# EAGLE schematic Matias_OBC-v.3.0 (EAGLE 9.4.2)
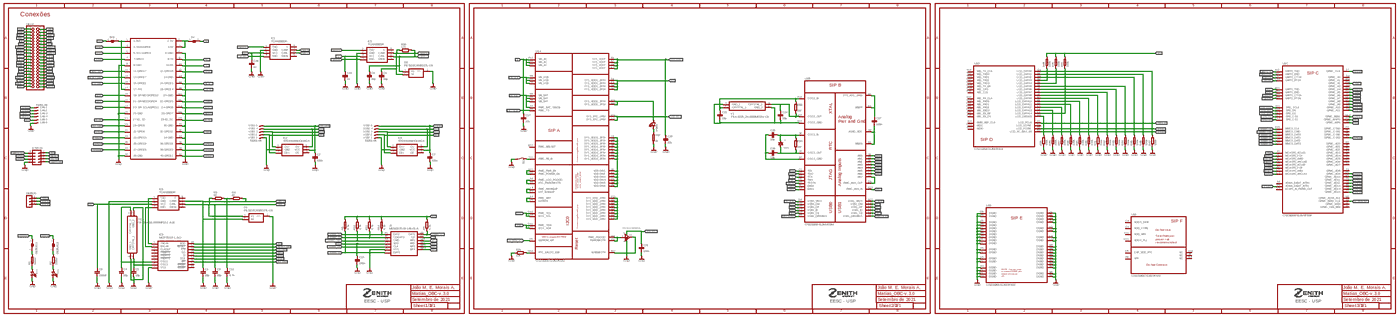
[diagram p0: schematic, sheet 1, overview]
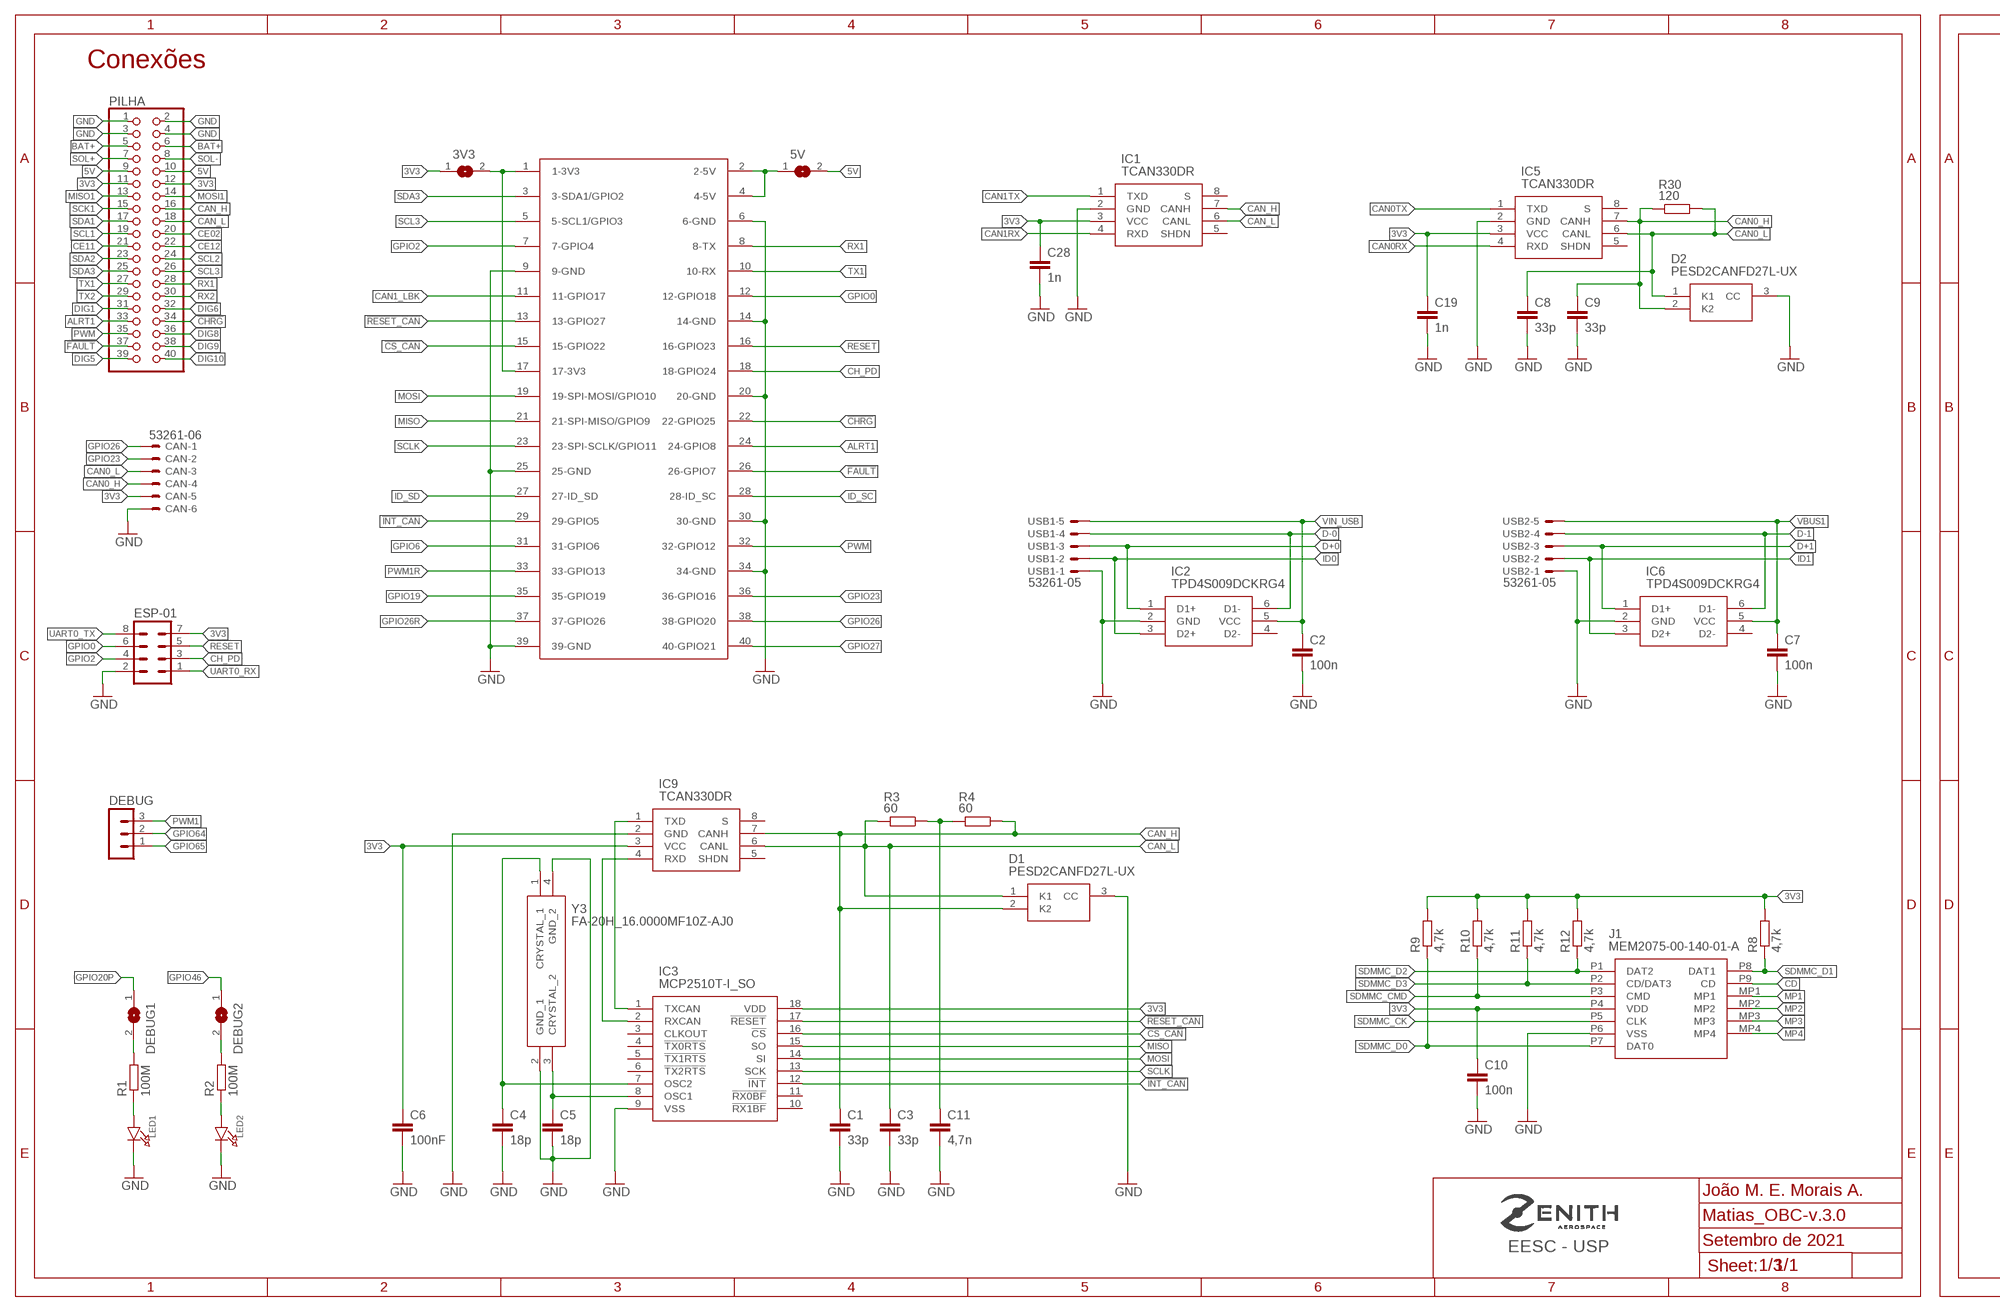
[diagram p1: schematic, sheet 1, part 1 of 4]
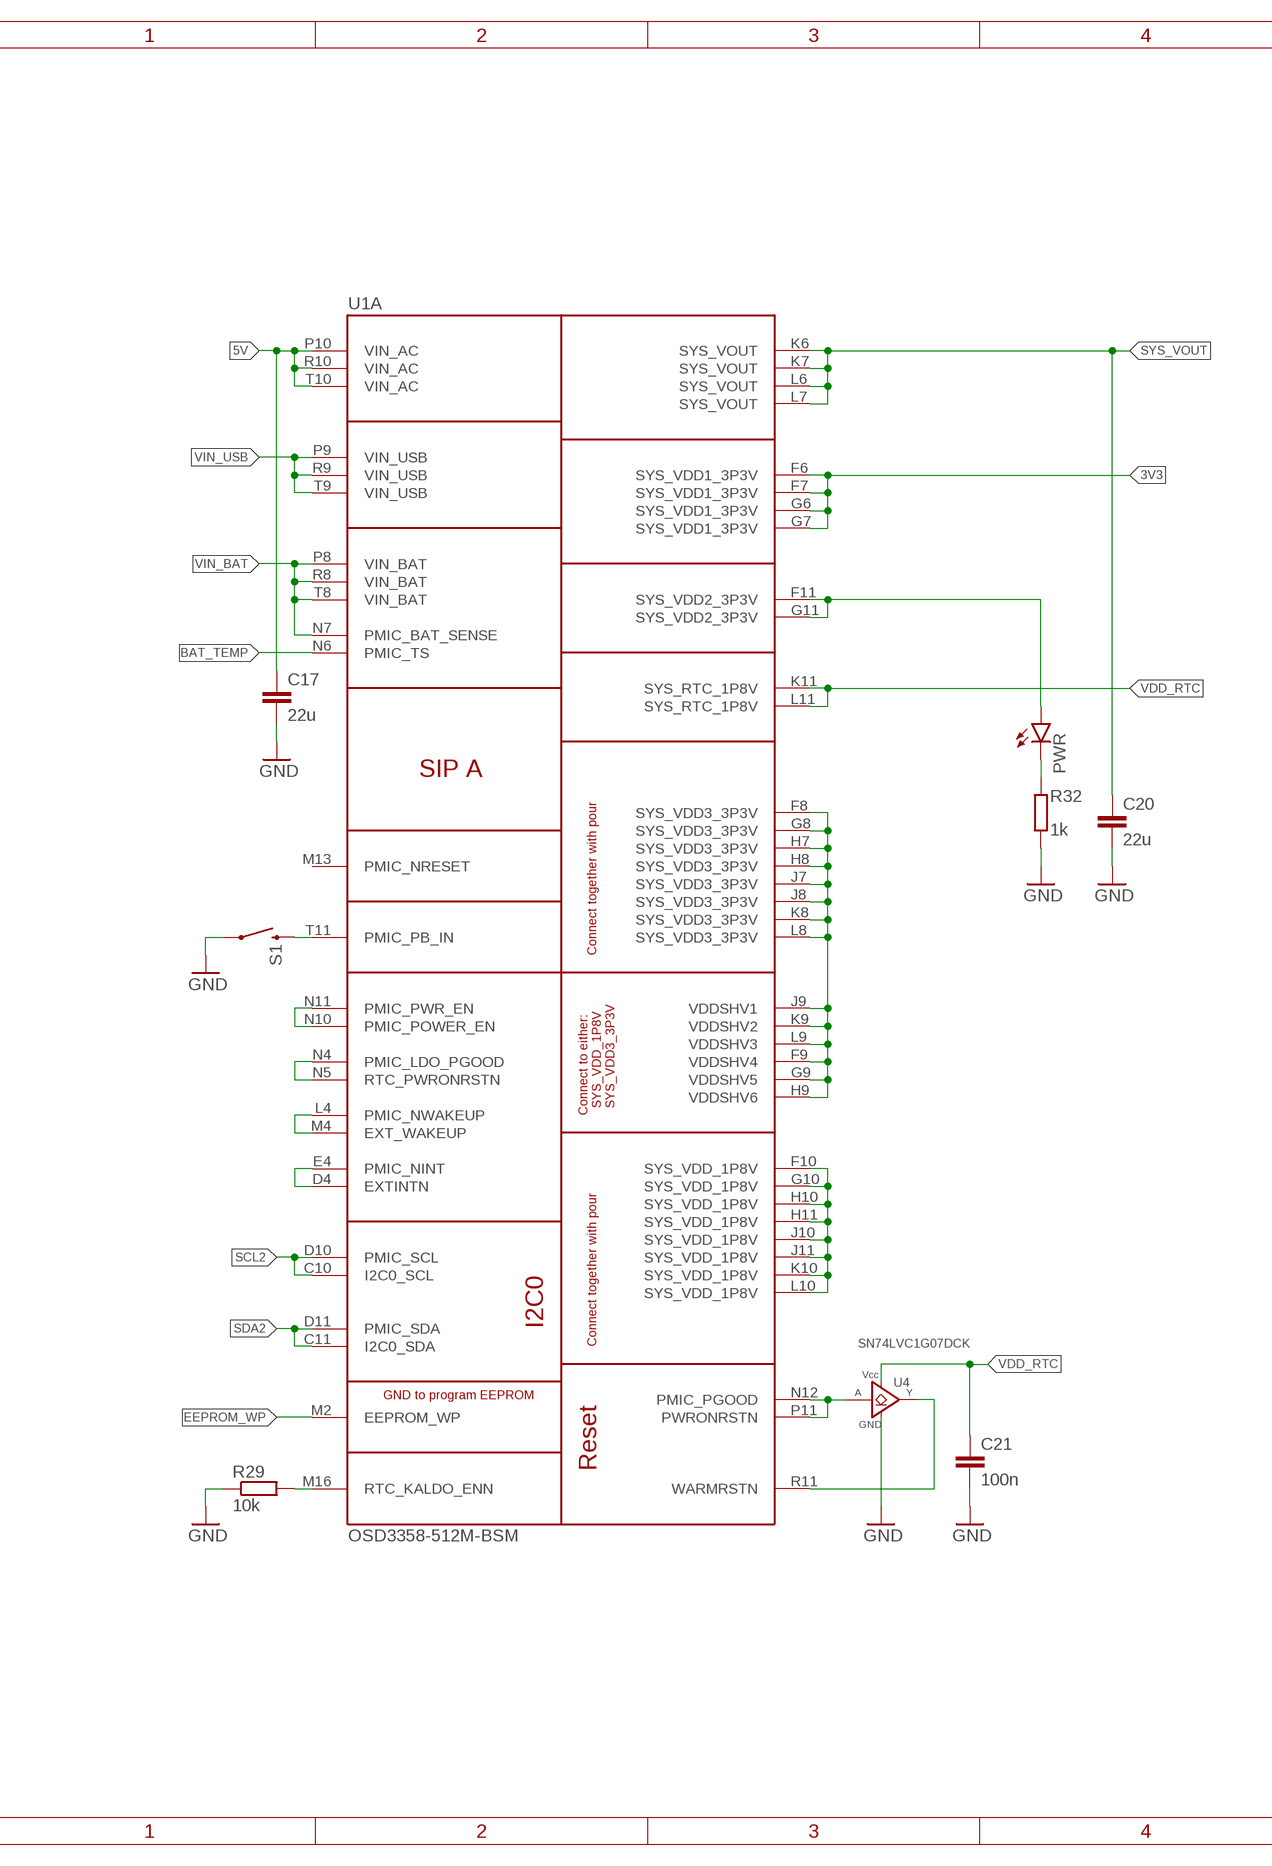
[diagram p2: schematic, sheet 1, part 2 of 4]
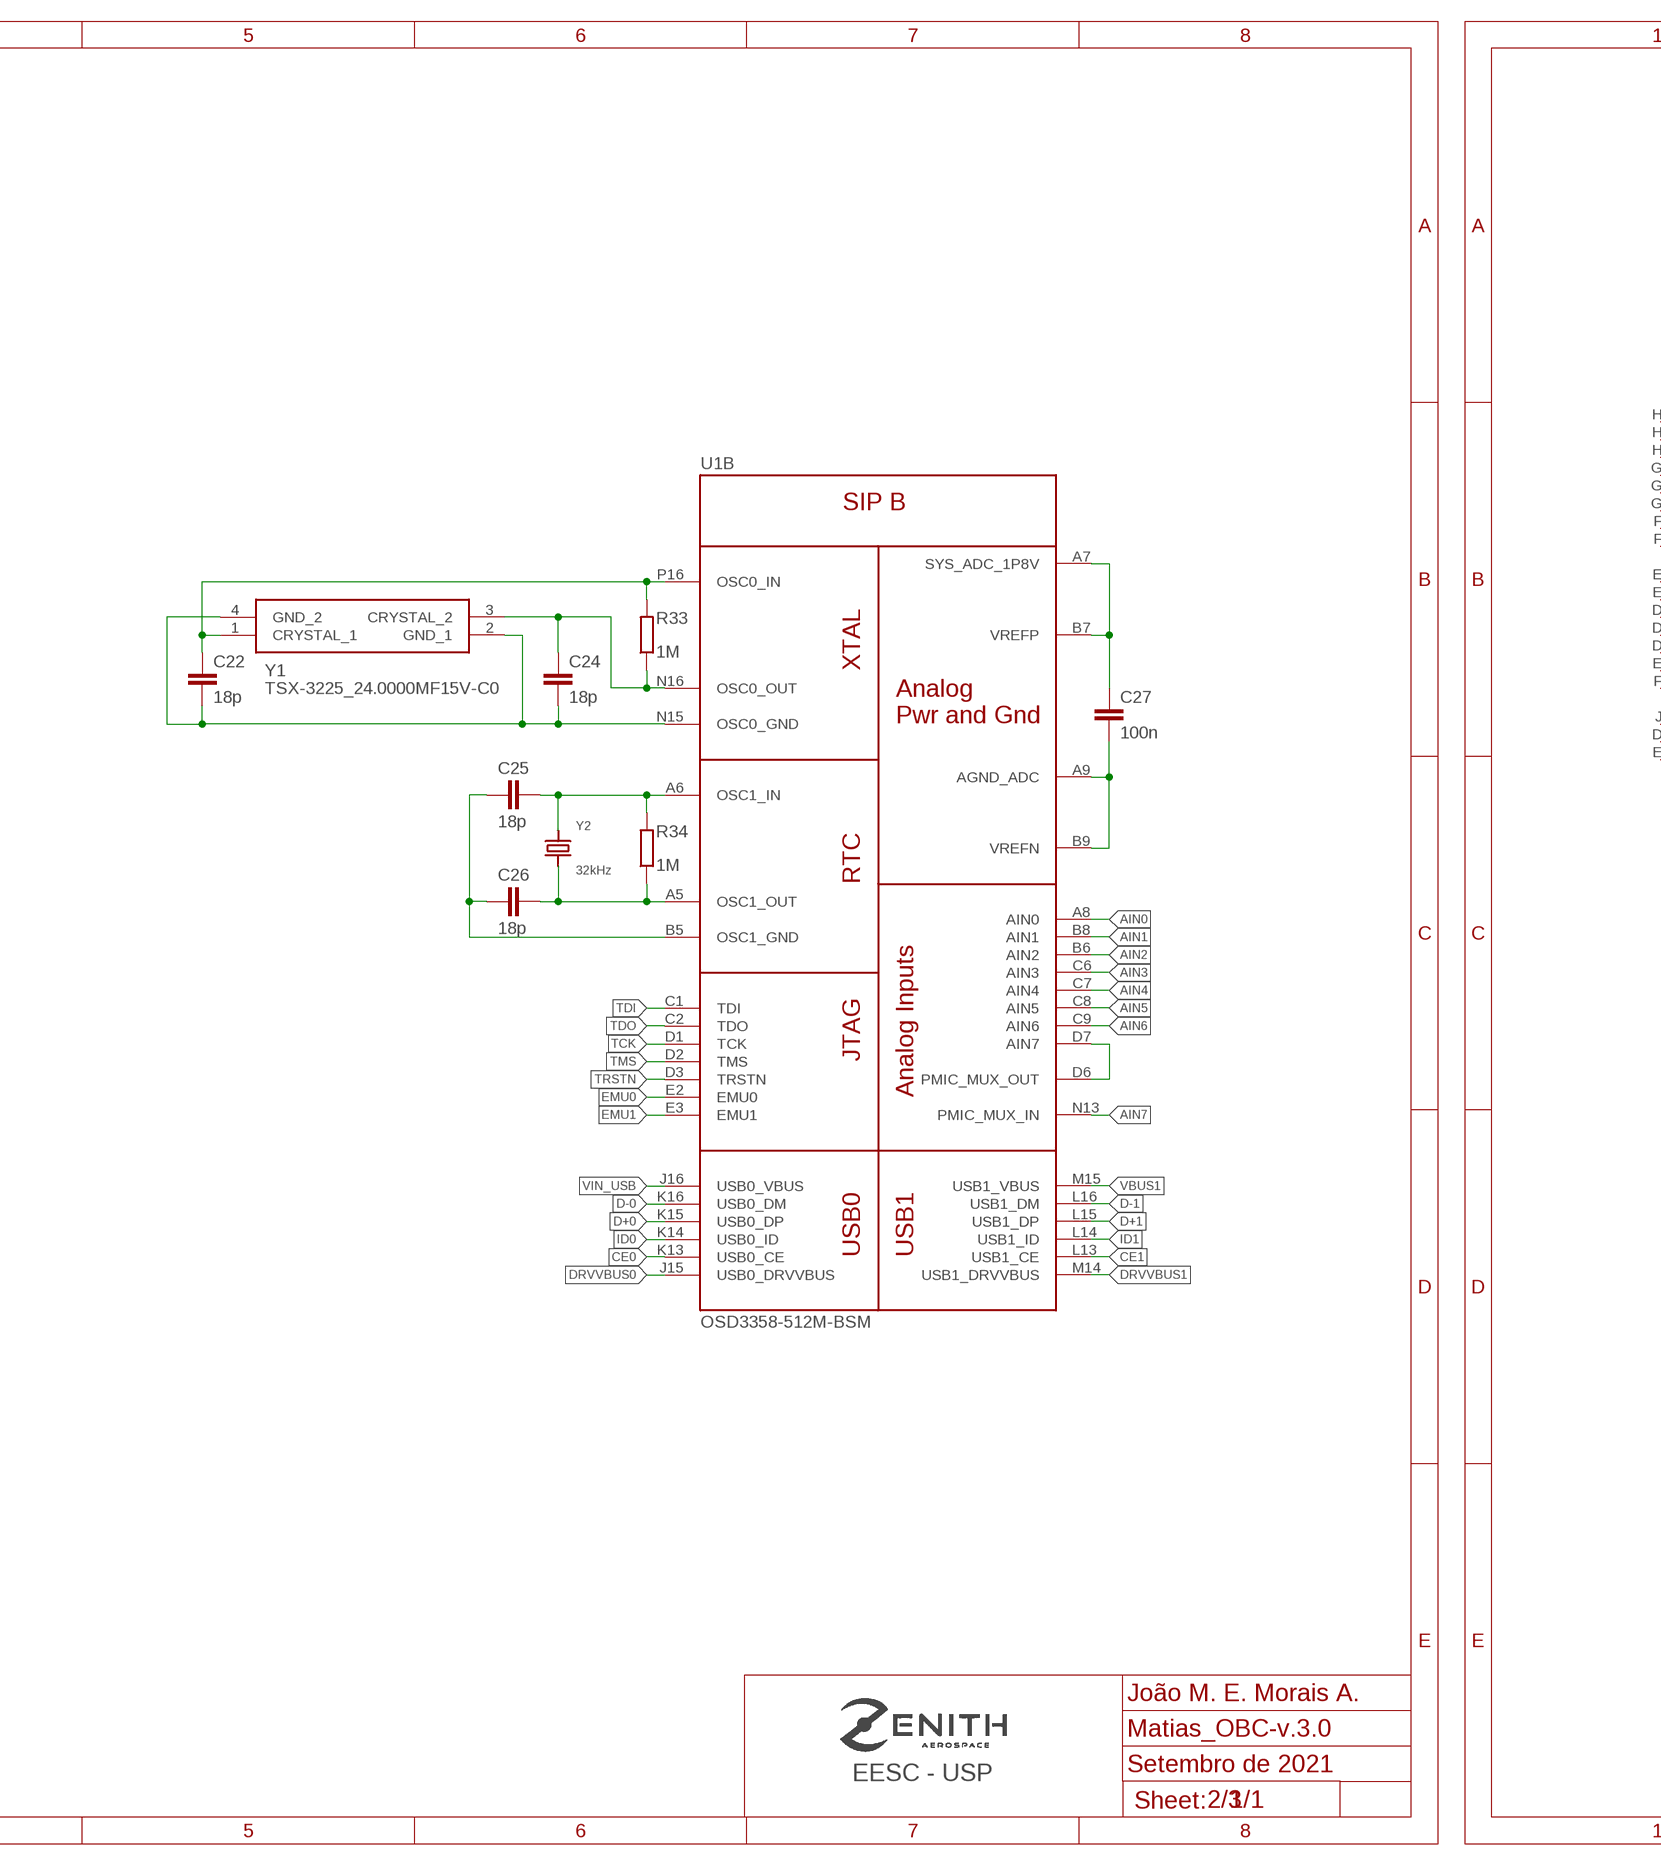
[diagram p3: schematic, sheet 1, part 3 of 4]
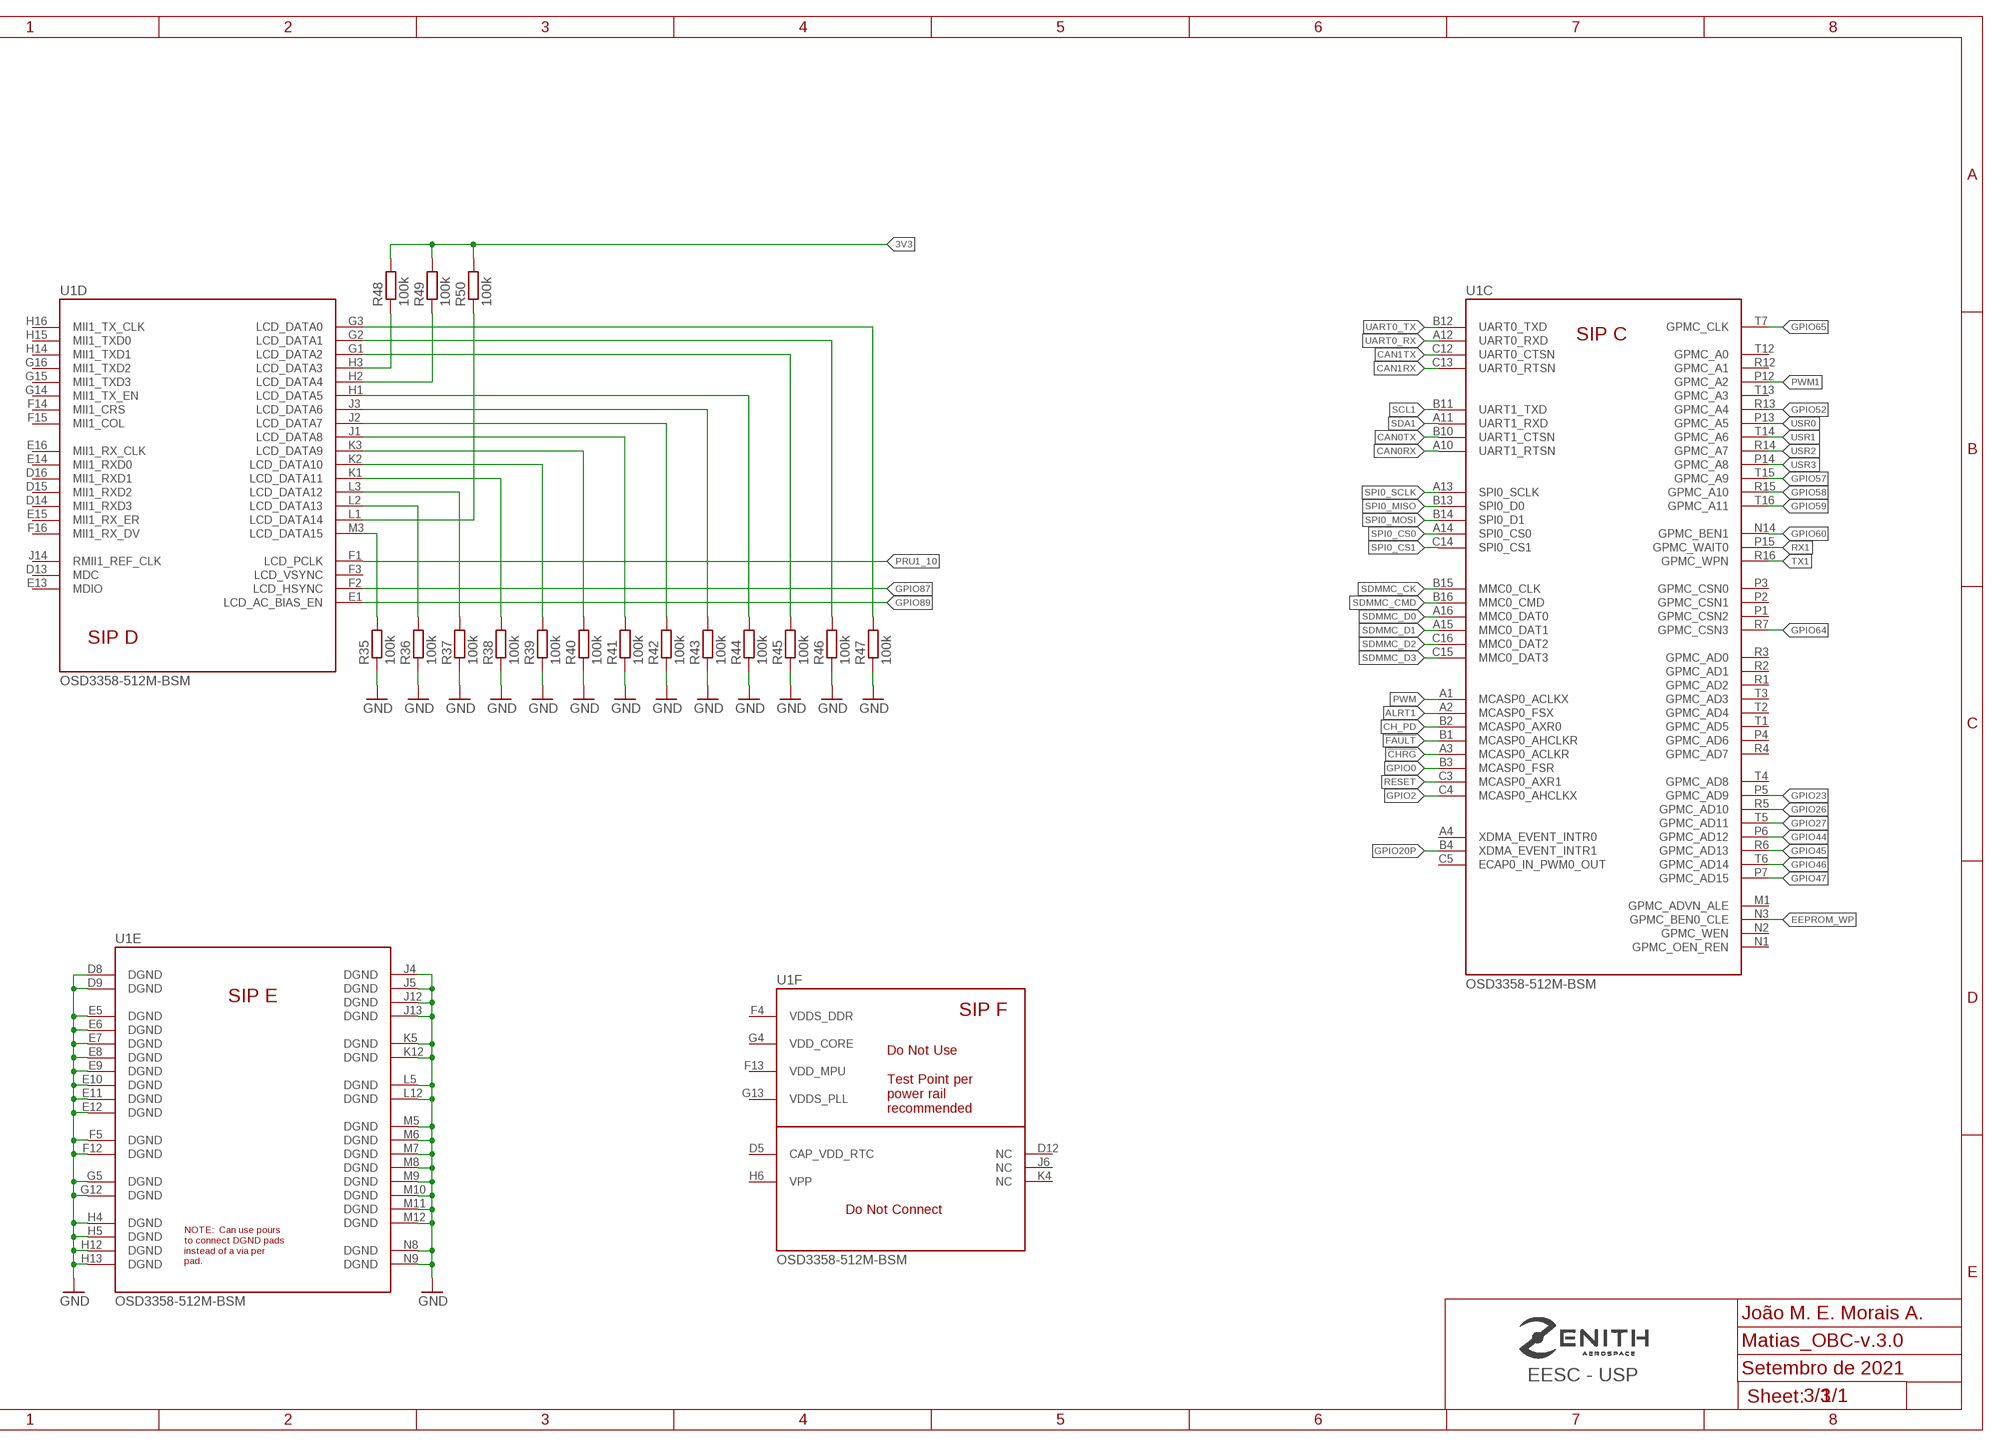
[diagram p4: schematic, sheet 1, part 4 of 4]

## Parts
3V3  SJ  [SJ]
5V  SJ  [SJ]
C1  33p  C-EUC0805  [C0805]
C2  100n  C-EUC0805  [C0805]
C3  33p  C-EUC0805  [C0805]
C4  18p  C-EUC0805  [C0805]
C5  18p  C-EUC0805  [C0805]
C6  100nF  C-EUC0805  [C0805]
C7  100n  C-EUC0805  [C0805]
C8  33p  C-EUC0805  [C0805]
C9  33p  C-EUC0805  [C0805]
C10  100n  C-EUC0805  [C0805]
C11  4,7n  C-EUC0805  [C0805]
C17  22u  C-EUC0805  [C0805]
C19  1n  C-EUC0805  [C0805]
C20  22u  C-EUC0805  [C0805]
C21  100n  C-EUC0805  [C0805]
C22  18p  C-EUC0805  [C0805]
C24  18p  C-EUC0805  [C0805]
C25  18p  C-EUC0805  [C0805]
C26  18p  C-EUC0805  [C0805]
C27  100n  C-EUC0805  [C0805]
C28  1n  C-EUC0805  [C0805]
CAN  53261-06  [53261-06]
D1  PESD2CANFD27L-UX  [SOT65P210X110-3N]
D2  PESD2CANFD27L-UX  [SOT65P210X110-3N]
DEBUG  MA03-1  [MA03-1]
DEBUG1  SOLDERJUMPERREFLOW_NOPASTE  [SOLDERJUMPER_REFLOW_NOPASTE]
DEBUG2  SOLDERJUMPERREFLOW_NOPASTE  [SOLDERJUMPER_REFLOW_NOPASTE]
ESP-01  MA04-2  [MA04-2]
IC1  TCAN330DR  [SOIC127P600X175-8N]
IC2  TPD4S009DCKRG4  [SOT65P210X110-6N]
IC3  MCP2510T-I_SO  [SOIC127P1030X265-18N]
IC5  TCAN330DR  [SOIC127P600X175-8N]
IC6  TPD4S009DCKRG4  [SOT65P210X110-6N]
IC9  TCAN330DR  [SOIC127P600X175-8N]
J1  MEM2075-00-140-01-A  [MEM20750014001A]
LED1  LED1206  [CHIPLED_1206]
LED2  LED1206  [CHIPLED_1206]
PILHA  PINHD-2X20  [2X20]
PWR  LEDCHIP-LED0805  [CHIP-LED0805]
R1  100M  R-EU_R0805  [R0805]
R2  100M  R-EU_R0805  [R0805]
R3  60  R-EU_R0805  [R0805]
R4  60  R-EU_R0805  [R0805]
R8  4,7k  R-EU_R0805  [R0805]
R9  4,7k  R-EU_R0805  [R0805]
R10  4,7k  R-EU_R0805  [R0805]
R11  4,7k  R-EU_R0805  [R0805]
R12  4,7k  R-EU_R0805  [R0805]
R29  10k  R-EU_R0805  [R0805]
R30  120  R-EU_R0805  [R0805]
R32  1k  R-EU_R0805  [R0805]
R33  1M  R-EU_R0805  [R0805]
R34  1M  R-EU_R0805  [R0805]
R35  100k  R-EU_R0805  [R0805]
R36  100k  R-EU_R0805  [R0805]
R37  100k  R-EU_R0805  [R0805]
R38  100k  R-EU_R0805  [R0805]
R39  100k  R-EU_R0805  [R0805]
R40  100k  R-EU_R0805  [R0805]
R41  100k  R-EU_R0805  [R0805]
R42  100k  R-EU_R0805  [R0805]
R43  100k  R-EU_R0805  [R0805]
R44  100k  R-EU_R0805  [R0805]
R45  100k  R-EU_R0805  [R0805]
R46  100k  R-EU_R0805  [R0805]
R47  100k  R-EU_R0805  [R0805]
R48  100k  R-EU_R0805  [R0805]
R49  100k  R-EU_R0805  [R0805]
R50  100k  R-EU_R0805  [R0805]
S1  MOMENTARY-SWITCH-SPST-SMD-6.0X3.5MM  [TACTILE_SWITCH_SMD_6.0X3.5MM]
U1  OSD3358-512M-BSM  [OSD335X-BGA-256]
U2  RASPBERRY-PI+PIZERO  [RASPBERRY-PI-ZERO]
U4  SN74LVC1G07DCK  [SC70(TI-DCK)]
USB1  53261-05  [53261-05]
USB2  53261-05  [53261-05]
Y1  TSX-3225_24.0000MF15V-C0  [TSX3225240000MF15VC0]
Y2  32kHz  CRYSTAL8X3.8SMT  [CRYSTAL_8X3.8]
Y3  FA-20H_16.0000MF10Z-AJ0  [FA20H160000MF12ZAC3]

## Nets
3V3: 3V3.1 C6.1 C10.1 C19.1 C28.1 CAN.5 ESP-01.7 IC1.3(VCC) IC3.18(VDD) IC5.3(VCC) IC9.3(VCC) J1.P4(VDD) PILHA.11 PILHA.12 R8.2 R9.2 R10.2 R11.2 R12.2 R48.2 R49.2 R50.2 U1.F6(A:SYS_VDD1_3P3V) U1.F7(A:SYS_VDD1_3P3V) U1.G6(A:SYS_VDD1_3P3V) U1.G7(A:SYS_VDD1_3P3V)
5V: 5V.2 C17.1 PILHA.9 PILHA.10 U1.P10(A:VIN_AC) U1.R10(A:VIN_AC) U1.T10(A:VIN_AC)
!CHRG: PILHA.34 U1.A3(C:MCASP0_ACLKR) U2.22(22-GPIO25)
!CS_CAN: IC3.16(!CS) U2.15(15-GPIO22)
!FAULT: PILHA.37 U1.B1(C:MCASP0_AHCLKR) U2.26(26-GPIO7)
!INT_CAN: IC3.12(!INT) U2.29(29-GPIO5)
!RESET_CAN: IC3.17(!RESET) U2.13(13-GPIO27)
AIN0: U1.A8(B:AIN0)
AIN1: U1.B8(B:AIN1)
AIN2: U1.B6(B:AIN2)
AIN3: U1.C6(B:AIN3)
AIN4: U1.C7(B:AIN4)
AIN5: U1.C8(B:AIN5)
AIN6: U1.C9(B:AIN6)
AIN7: U1.N13(B:PMIC_MUX_IN)
ALRT1: PILHA.33 U1.A2(C:MCASP0_FSX) U2.24(24-GPIO8)
BAT+: PILHA.5 PILHA.6
BAT_TEMP: U1.N6(A:PMIC_TS)
CAN0_H: C9.1 CAN.4 D2.2(K2) IC5.7(CANH) R30.1
CAN0_L: C8.1 CAN.3 D2.1(K1) IC5.6(CANL) R30.2
CAN0RX: IC5.4(RXD) U1.A10(C:UART1_RTSN)
CAN0TX: IC5.1(TXD) U1.B10(C:UART1_CTSN)
CAN1_LBK: U2.11(11-GPIO17)
CAN1RX: IC1.4(RXD) U1.C13(C:UART0_RTSN)
CAN1TX: IC1.1(TXD) U1.C12(C:UART0_CTSN)
CAN_H: C1.1 D1.2(K2) IC1.7(CANH) IC9.7(CANH) PILHA.16 R4.1
CAN_L: C3.1 D1.1(K1) IC1.6(CANL) IC9.6(CANL) PILHA.18 R3.2
CD: J1.P9(CD)
CE0: U1.K13(B:USB0_CE)
CE1: U1.L13(B:USB1_CE)
CE02: PILHA.20
CE11: PILHA.21
CE12: PILHA.22
CH_PD: ESP-01.3 U1.B2(C:MCASP0_AXR0) U2.18(18-GPIO24)
D+0: IC2.1(D1+) U1.K15(B:USB0_DP) USB1.3
D+1: IC6.1(D1+) U1.L15(B:USB1_DP) USB2.3
D-0: IC2.6(D1-) U1.K16(B:USB0_DM) USB1.4
D-1: IC6.6(D1-) U1.L16(B:USB1_DM) USB2.4
DIG1: PILHA.31
DIG5: PILHA.39
DIG6: PILHA.32
DIG8: PILHA.36
DIG9: PILHA.38
DIG10: PILHA.40
DRVVBUS0: U1.J15(B:USB0_DRVVBUS)
DRVVBUS1: U1.M14(B:USB1_DRVVBUS)
EEPROM_WP: U1.M2(A:EEPROM_WP) U1.N3(C:GPMC_BEN0_CLE)
EMU0: U1.E2(B:EMU0)
EMU1: U1.E3(B:EMU1)
GND: C1.2 C2.2 C3.2 C4.2 C5.2 C6.2 C7.2 C8.2 C9.2 C10.2 C11.2 C17.2 C19.2 C20.2 C21.2 C28.2 CAN.6 D1.3(CC) D2.3(CC) ESP-01.2 IC1.2(GND) IC2.2(GND) IC3.9(VSS) IC5.2(GND) IC6.2(GND) IC9.2(GND) J1.P6(VSS) LED1.C LED2.C PILHA.1 PILHA.2 PILHA.3 PILHA.4 R29.1 R32.1 R35.1 R36.1 R37.1 R38.1 R39.1 R40.1 R41.1 R42.1 R43.1 R44.1 R45.1 R46.1 R47.1 S1.1 U1.D8(E:DGND) U1.D9(E:DGND) U1.E5(E:DGND) U1.E6(E:DGND) U1.E7(E:DGND) U1.E8(E:DGND) U1.E9(E:DGND) U1.E10(E:DGND) U1.E11(E:DGND) U1.E12(E:DGND) U1.F5(E:DGND) U1.F12(E:DGND) U1.G5(E:DGND) U1.G12(E:DGND) U1.H4(E:DGND) U1.H5(E:DGND) U1.H12(E:DGND) U1.H13(E:DGND) U1.J4(E:DGND) U1.J5(E:DGND) U1.J12(E:DGND) U1.J13(E:DGND) U1.K5(E:DGND) U1.K12(E:DGND) U1.L5(E:DGND) U1.L12(E:DGND) U1.M5(E:DGND) U1.M6(E:DGND) U1.M7(E:DGND) U1.M8(E:DGND) U1.M9(E:DGND) U1.M10(E:DGND) U1.M11(E:DGND) U1.M12(E:DGND) U1.N8(E:DGND) U1.N9(E:DGND) U2.6(6-GND) U2.9(9-GND) U2.14(14-GND) U2.20(20-GND) U2.25(25-GND) U2.30(30-GND) U2.34(34-GND) U2.39(39-GND) U4.3(GND) USB1.1 USB2.1 Y3.2(GND_1) Y3.4(GND_2)
GPIO0: ESP-01.6 U1.B3(C:MCASP0_FSR) U2.12(12-GPIO18)
GPIO2: ESP-01.4 U1.C4(C:MCASP0_AHCLKX) U2.7(7-GPIO4)
GPIO6: U2.31(31-GPIO6)
GPIO19: U2.35(35-GPIO19)
GPIO20P: DEBUG1.1 U1.B4(C:XDMA_EVENT_INTR1)
GPIO23: CAN.2 U1.P5(C:GPMC_AD9) U2.36(36-GPIO16)
GPIO26: CAN.1 U1.R5(C:GPMC_AD10) U2.38(38-GPIO20)
GPIO26R: U2.37(37-GPIO26)
GPIO27: U1.T5(C:GPMC_AD11) U2.40(40-GPIO21)
GPIO44: U1.P6(C:GPMC_AD12)
GPIO45: U1.R6(C:GPMC_AD13)
GPIO46: DEBUG2.1 U1.T6(C:GPMC_AD14)
GPIO47: U1.P7(C:GPMC_AD15)
GPIO52: U1.R13(C:GPMC_A4)
GPIO57: U1.T15(C:GPMC_A9)
GPIO58: U1.R15(C:GPMC_A10)
GPIO59: U1.T16(C:GPMC_A11)
GPIO60: U1.N14(C:GPMC_BEN1)
GPIO64: DEBUG.2 U1.R7(C:GPMC_CSN3)
GPIO65: DEBUG.1 U1.T7(C:GPMC_CLK)
GPIO87: U1.F2(D:LCD_HSYNC)
GPIO89: U1.E1(D:LCD_AC_BIAS_EN)
ID0: IC2.3(D2+) U1.K14(B:USB0_ID) USB1.2
ID1: IC6.3(D2+) U1.L14(B:USB1_ID) USB2.2
ID_SC: U2.28(28-ID_SC)
ID_SD: U2.27(27-ID_SD)
MISO: IC3.15(SO) U2.21(21-SPI-MISO/GPIO9)
MISO1: PILHA.13
MOSI: IC3.14(SI) U2.19(19-SPI-MOSI/GPIO10)
MOSI1: PILHA.14
MP1: J1.MP1
MP2: J1.MP2
MP3: J1.MP3
MP4: J1.MP4
N$1: LED1.A R1.1
N$2: 5V.1 U2.2(2-5V) U2.4(4-5V)
N$3: 3V3.2 U2.1(1-3V3) U2.17(17-3V3)
N$4: C11.1 R3.1 R4.2
N$5: LED2.A R2.1
N$6: DEBUG1.2 R1.2
N$7: DEBUG2.2 R2.2
N$8: C5.1 IC3.8(OSC1) Y3.3(CRYSTAL_2)
N$9: C4.1 IC3.7(OSC2) Y3.1(CRYSTAL_1)
N$51: S1.2 U1.T11(A:PMIC_PB_IN)
N$52: U1.N10(A:PMIC_POWER_EN) U1.N11(A:PMIC_PWR_EN)
N$53: U1.N4(A:PMIC_LDO_PGOOD) U1.N5(A:RTC_PWRONRSTN)
N$54: U1.L4(A:PMIC_NWAKEUP) U1.M4(A:EXT_WAKEUP)
N$55: U1.D4(A:EXTINTN) U1.E4(A:PMIC_NINT)
N$56: R29.2 U1.M16(A:RTC_KALDO_ENN)
N$57: PWR.A U1.F11(A:SYS_VDD2_3P3V) U1.G11(A:SYS_VDD2_3P3V)
N$58: PWR.C R32.2
N$59: U1.F8(A:SYS_VDD3_3P3V) U1.F9(A:VDDSHV4) U1.G8(A:SYS_VDD3_3P3V) U1.G9(A:VDDSHV5) U1.H7(A:SYS_VDD3_3P3V) U1.H8(A:SYS_VDD3_3P3V) U1.H9(A:VDDSHV6) U1.J7(A:SYS_VDD3_3P3V) U1.J8(A:SYS_VDD3_3P3V) U1.J9(A:VDDSHV1) U1.K8(A:SYS_VDD3_3P3V) U1.K9(A:VDDSHV2) U1.L8(A:SYS_VDD3_3P3V) U1.L9(A:VDDSHV3)
N$60: U1.F10(A:SYS_VDD_1P8V) U1.G10(A:SYS_VDD_1P8V) U1.H10(A:SYS_VDD_1P8V) U1.H11(A:SYS_VDD_1P8V) U1.J10(A:SYS_VDD_1P8V) U1.J11(A:SYS_VDD_1P8V) U1.K10(A:SYS_VDD_1P8V) U1.L10(A:SYS_VDD_1P8V)
N$61: U1.N12(A:PMIC_PGOOD) U1.P11(A:PWRONRSTN) U4.2(A)
N$62: U1.R11(A:WARMRSTN) U4.4(Y)
N$63: C22.1 R33.2 U1.P16(B:OSC0_IN) Y1.1(CRYSTAL_1)
N$64: C24.1 R33.1 U1.N16(B:OSC0_OUT) Y1.3(CRYSTAL_2)
N$65: C22.2 C24.2 U1.N15(B:OSC0_GND) Y1.2(GND_1) Y1.4(GND_2)
N$66: C26.1 R34.1 U1.A5(B:OSC1_OUT) Y2.P$4
N$67: C25.1 R34.2 U1.A6(B:OSC1_IN) Y2.P$1
N$68: C25.2 C26.2 U1.B5(B:OSC1_GND)
N$69: U1.D6(B:PMIC_MUX_OUT) U1.D7(B:AIN7)
N$70: C27.2 U1.A9(B:AGND_ADC) U1.B9(B:VREFN)
N$71: C27.1 U1.A7(B:SYS_ADC_1P8V) U1.B7(B:VREFP)
N$72: R35.2 U1.M3(D:LCD_DATA15)
N$73: R36.2 U1.L2(D:LCD_DATA13)
N$74: R37.2 U1.L3(D:LCD_DATA12)
N$75: R38.2 U1.K1(D:LCD_DATA11)
N$76: R39.2 U1.K2(D:LCD_DATA10)
N$77: R40.2 U1.K3(D:LCD_DATA9)
N$78: R41.2 U1.J1(D:LCD_DATA8)
N$79: R42.2 U1.J2(D:LCD_DATA7)
N$80: R43.2 U1.J3(D:LCD_DATA6)
N$81: R44.2 U1.H1(D:LCD_DATA5)
N$82: R45.2 U1.G1(D:LCD_DATA2)
N$83: R46.2 U1.G2(D:LCD_DATA1)
N$84: R47.2 U1.G3(D:LCD_DATA0)
N$85: R48.1 U1.H3(D:LCD_DATA3)
N$86: R49.1 U1.H2(D:LCD_DATA4)
N$87: R50.1 U1.L1(D:LCD_DATA14)
PRU1_10: U1.F1(D:LCD_PCLK)
PWM: PILHA.35 U1.A1(C:MCASP0_ACLKX) U2.32(32-GPIO12)
PWM1: DEBUG.3 U1.P12(C:GPMC_A2)
PWM1R: U2.33(33-GPIO13)
RESET: ESP-01.5 U1.C3(C:MCASP0_AXR1) U2.16(16-GPIO23)
RX1: PILHA.28 U1.P15(C:GPMC_WAIT0) U2.8(8-TX)
RX2: PILHA.30
RXCAN1: IC3.2(RXCAN) IC9.4(RXD)
SCK1: PILHA.15
SCL1: PILHA.19 U1.B11(C:UART1_TXD)
SCL2: PILHA.24 U1.C10(A:I2C0_SCL) U1.D10(A:PMIC_SCL)
SCL3: PILHA.26 U2.5(5-SCL1/GPIO3)
SCLK: IC3.13(SCK) U2.23(23-SPI-SCLK/GPIO11)
SDA1: PILHA.17 U1.A11(C:UART1_RXD)
SDA2: PILHA.23 U1.C11(A:I2C0_SDA) U1.D11(A:PMIC_SDA)
SDA3: PILHA.25 U2.3(3-SDA1/GPIO2)
SDMMC_CK: J1.P5(CLK) U1.B15(C:MMC0_CLK)
SDMMC_CMD: J1.P3(CMD) R10.1 U1.B16(C:MMC0_CMD)
SDMMC_D0: J1.P7(DAT0) R9.1 U1.A16(C:MMC0_DAT0)
SDMMC_D1: J1.P8(DAT1) R8.1 U1.A15(C:MMC0_DAT1)
SDMMC_D2: J1.P1(DAT2) R12.1 U1.C16(C:MMC0_DAT2)
SDMMC_D3: J1.P2(CD/DAT3) R11.1 U1.C15(C:MMC0_DAT3)
SOL+: PILHA.7
SOL-: PILHA.8
SPI0_CS0: U1.A14(C:SPI0_CS0)
SPI0_CS1: U1.C14(C:SPI0_CS1)
SPI0_MISO: U1.B13(C:SPI0_D0)
SPI0_MOSI: U1.B14(C:SPI0_D1)
SPI0_SCLK: U1.A13(C:SPI0_SCLK)
SYS_VOUT: C20.1 U1.K6(A:SYS_VOUT) U1.K7(A:SYS_VOUT) U1.L6(A:SYS_VOUT) U1.L7(A:SYS_VOUT)
TCK: U1.D1(B:TCK)
TDI: U1.C1(B:TDI)
TDO: U1.C2(B:TDO)
TMS: U1.D2(B:TMS)
TRSTN: U1.D3(B:TRSTN)
TX1: PILHA.27 U1.R16(C:GPMC_WPN) U2.10(10-RX)
TX2: PILHA.29
TXCAN1: IC3.1(TXCAN) IC9.1(TXD)
UART0_RX: ESP-01.1 U1.A12(C:UART0_RXD)
UART0_TX: ESP-01.8 U1.B12(C:UART0_TXD)
USR0: U1.P13(C:GPMC_A5)
USR1: U1.T14(C:GPMC_A6)
USR2: U1.R14(C:GPMC_A7)
USR3: U1.P14(C:GPMC_A8)
VBUS1: C7.1 IC6.5(VCC) U1.M15(B:USB1_VBUS) USB2.5
VDD_RTC: C21.1 U1.K11(A:SYS_RTC_1P8V) U1.L11(A:SYS_RTC_1P8V) U4.5(VCC)
VIN_BAT: U1.N7(A:PMIC_BAT_SENSE) U1.P8(A:VIN_BAT) U1.R8(A:VIN_BAT) U1.T8(A:VIN_BAT)
VIN_USB: C2.1 IC2.5(VCC) U1.J16(B:USB0_VBUS) U1.P9(A:VIN_USB) U1.R9(A:VIN_USB) U1.T9(A:VIN_USB) USB1.5
Unconnected: IC1.5(SHDN) IC1.8(S) IC2.4(D2-) IC3.3(CLKOUT) IC3.4(!TX0RTS) IC3.5(!TX1RTS) IC3.6(!TX2RTS) IC3.10(!RX1BF) IC3.11(!RX0BF) IC5.5(SHDN) IC5.8(S) IC6.4(D2-) IC9.5(SHDN) IC9.8(S) U1.A4(C:XDMA_EVENT_INTR0) U1.C5(C:ECAP0_IN_PWM0_OUT) U1.D5(F:CAP_VDD_RTC) U1.D12(F:NC) U1.D13(D:MDC) U1.D14(D:MII1_RXD3) U1.D15(D:MII1_RXD2) U1.D16(D:MII1_RXD1) U1.E13(D:MDIO) U1.E14(D:MII1_RXD0) U1.E15(D:MII1_RX_ER) U1.E16(D:MII1_RX_CLK) U1.F3(D:LCD_VSYNC) U1.F4(F:VDDS_DDR) U1.F13(F:VDD_MPU) U1.F14(D:MII1_CRS) U1.F15(D:MII1_COL) U1.F16(D:MII1_RX_DV) U1.G4(F:VDD_CORE) U1.G13(F:VDDS_PLL) U1.G14(D:MII1_TX_EN) U1.G15(D:MII1_TXD3) U1.G16(D:MII1_TXD2) U1.H6(F:VPP) U1.H14(D:MII1_TXD1) U1.H15(D:MII1_TXD0) U1.H16(D:MII1_TX_CLK) U1.J6(F:NC) U1.J14(D:RMII1_REF_CLK) U1.K4(F:NC) U1.M1(C:GPMC_ADVN_ALE) U1.M13(A:PMIC_NRESET) U1.N1(C:GPMC_OEN_REN) U1.N2(C:GPMC_WEN) U1.P1(C:GPMC_CSN2) U1.P2(C:GPMC_CSN1) U1.P3(C:GPMC_CSN0) U1.P4(C:GPMC_AD6) U1.R1(C:GPMC_AD2) U1.R2(C:GPMC_AD1) U1.R3(C:GPMC_AD0) U1.R4(C:GPMC_AD7) U1.R12(C:GPMC_A1) U1.T1(C:GPMC_AD5) U1.T2(C:GPMC_AD4) U1.T3(C:GPMC_AD3) U1.T4(C:GPMC_AD8) U1.T12(C:GPMC_A0) U1.T13(C:GPMC_A3)

## Notes on the sheet
- Conexões
- João M. E. Morais A. | João M. E. Morais A. | João M. E. Morais A.
- EESC - USP | Setembro de 2021 | EESC - USP | Setembro de 2021 | EESC - USP | Setembro de 2021
- 1/3 | 2/3 | 3/3
- C:/Users/marcu/Desktop/Ensino Superior/Graduação - Eng Elétrica/Zenith/zenith-v2.bmp | C:/Users/marcu/Desktop/Ensino Superior/Graduação - Eng Elétrica/Zenith/zenith-v2.bmp | C:/Users/marcu/Desktop/Ensino Superior/Graduação - Eng Elétrica/Zenith/zenith-v2.bmp

## Library data of the parts
3V3 5V = jumper:SJ: SMD solder JUMPER
C1-C11 C17 C19-C22 C24-C28 = rcl:C-EU: CAPACITOR, European symbol; SPICEPREFIX: C
CAN = con-molex:53?-06: CONNECTOR wire to board 1.25 mm (.049 inch) pitch header; MF: MOLEX; OC_FARNELL: 1125375; OC_NEWARK: unknown
D1 D2 = SamacSys_Parts:PESD2CANFD27L-UX: PESD2CANFD27L-U - ESD protection for In-vehicle networks Source: Datasheet <https://assets.nexperia.com/documents/data-sheet/PESD2CANFD27L-U.pdf>; DESCRIPTION: PESD2CANFD27L-U - ESD protection for In-vehicle networks; HEIGHT: 1.1mm; MANUFACTURER_NAME: Nexperia; MANUFACTURER_PART_NUMBER: PESD2CANFD27L-UX; MOUSER_PART_NUMBER: 771-PESD2CANFD27L-UX; MOUSER_PRICE-STOCK: https://www.mouser.co.uk/ProductDetail/Nexperia/PESD2CANFD27L-UX?qs=sPbYRqrBIVkgjetV%2FANAFQ%3D%3D
DEBUG = con-lstb:MA03-1: PIN HEADER; OC_FARNELL: unknown; OC_NEWARK: unknown
DEBUG1 DEBUG2 = microbuilder:SOLDERJUMPER: SMD Solder JUMPER Solder the two pads together to create a connection, or remove the solder to break it. REFLOW - Use this footprint for solder paste and reflow ovens. WAVE - Use this footprint for hand-soldering (larger pads). CLOSED - Has a trace between the two pads to ensure it is closed by default. The trace needs to be cut to disable the jumper, and can be closed again by creating a solder bridge between the two pads.
ESP-01 = con-lstb:MA04-2: PIN HEADER; OC_FARNELL: unknown; OC_NEWARK: unknown
IC1 IC5 IC9 = SamacSys_Parts:TCAN330DR: 3.3-V CAN Transceivers Source: Datasheet <http://www.ti.com/lit/gpn/TCAN330>; DESCRIPTION: 3.3-V CAN Transceivers; HEIGHT: 1.75mm; MANUFACTURER_NAME: Texas Instruments; MANUFACTURER_PART_NUMBER: TCAN330DR; MOUSER_PART_NUMBER: 595-TCAN330DR; MOUSER_PRICE-STOCK: https://www.mouser.co.uk/ProductDetail/Texas-Instruments/TCAN330DR?qs=9DwIlvx97afvSza3n7zoBw%3D%3D
IC2 IC6 = SamacSys_Parts:TPD4S009DCKRG4: ESD Suppressors / TVS Diodes 4 Ch Display/HDMI Port ESD Protection Source: Datasheet <https://www.ti.com/lit/ds/symlink/tpd4s009.pdf?HQS=TI-null-null-mousermode-df-pf-null-wwe&ts=1605773480012&ref_url=https%3A%2F%2Fwww.mouser.in%2F>; DESCRIPTION: ESD Suppressors / TVS Diodes 4 Ch Display/HDMI Port ESD Protection; HEIGHT: 1.1mm; MANUFACTURER_NAME: Texas Instruments; MANUFACTURER_PART_NUMBER: TPD4S009DCKRG4; MOUSER_PART_NUMBER: 595-TPD4S009DCKRG4; MOUSER_PRICE-STOCK: https://www.mouser.co.uk/ProductDetail/Texas-Instruments/TPD4S009DCKRG4/?qs=XGzIaZb%2FFYJF2wO%2FD%252BYU0w%3D%3D
IC3 = SamacSys_Parts:MCP2510T-I_SO: IC, CAN Controller, stand alone, MCP2510T-I/SO Source: Datasheet <http://ww1.microchip.com/downloads/en/DeviceDoc/21291F.pdf>; DESCRIPTION: IC, CAN Controller, stand alone, MCP2510T-I/SO; HEIGHT: 2.65mm; MANUFACTURER_NAME: Microchip; MANUFACTURER_PART_NUMBER: MCP2510T-I/SO; MOUSER_PART_NUMBER: 579-MCP2510T-I/SO; MOUSER_PRICE-STOCK: https://www.mouser.co.uk/ProductDetail/Microchip-Technology/MCP2510T-I-SO?qs=uMUszenkLLI5KRGT%252BhzzUQ%3D%3D
J1 = SamacSys_Parts:MEM2075-00-140-01-A: GCT (GLOBAL CONNECTOR TECHNOLOGY) - MEM2075-00-140-01-A - MICRO SD CARD CONN, PUSH-PUSH, 9POS, SMT Source: Datasheet; DESCRIPTION: GCT (GLOBAL CONNECTOR TECHNOLOGY) - MEM2075-00-140-01-A - MICRO SD CARD CONN, PUSH-PUSH, 9POS, SMT; HEIGHT: 1.45mm; MANUFACTURER_NAME: GCT (GLOBAL CONNECTOR TECHNOLOGY); MANUFACTURER_PART_NUMBER: MEM2075-00-140-01-A; MOUSER_PART_NUMBER: 640-MEM20750014001A; MOUSER_PRICE-STOCK: https://www.mouser.co.uk/ProductDetail/GCT/MEM2075-00-140-01-A?qs=KUoIvG%2F9IlZvfWpeERlq3Q%3D%3D
LED1 LED2 = microbuilder:LED: LED
PILHA = pinhead:PINHD-2X20: PIN HEADER
PWR = led:LED: LED
R1-R4 R8-R12 R29 R30 R32-R50 = rcl:R-EU_: RESISTOR, European symbol; SPICEPREFIX: R
S1 = SparkFun-Switches:MOMENTARY-SWITCH-SPST: Momentary Switch (Pushbutton) - SPST Normally-open (NO) SPST momentary switches (buttons, pushbuttons). Variants PTH-12MM - 12mm square, through-hole Momentary Pushbutton Switch - 12mm Square <https://www.sparkfun.com/products/9190> (COM-09190) PTH-6.0MM, PTH-6.0MM-KIT - 6.0mm square, through-hole Mini Pushbutton Switch <https://www.sparkfun.com/products/97> (COM-00097) KIT package intended for soldering kit's - only one side of pads' copper is exposed. PTH-RIGHT-ANGLE-KIT - Right-angle, through-hole Right Angle Tactile Button <https://www.sparkfun.com/products/10791> - Used on SparkFun BigTime Watch Kit <https://www.sparkfun.com/products/11734> SMD-12MM - 12mm square, surface-mount Tactile Button - SMD (12mm) <https://www.sparkfun.com/products/12993> (COM-12993) Used on SparkFun PicoBoard <https://www.sparkfun.com/products/11888> SMD-4.5MM - 4.5mm Square Trackball Switch Used on SparkFun Blackberry Trackballer Breakout <https://www.sparkfun.com/products/13169> SMD-4.6MMX2.8MM - 4.60mm x 2.80mm, surface mount Used on SparkFun SAMD21 Mini Breakout <https://www.sparkfun.com/products/13664> SMD-5.2MM, SMD-5.2-REDUNDANT - 5.2mm square, surface-mount Mini Pushbutton Switch - SMD <https://www.sparkfun.com/products/8720> (COM-08720) Used on Arduino Pro Mini <https://www.sparkfun.com/products/11114> REDUNDANT package connects both switch circuits together SMD-6.0X3.5MM - 6.0 x 3.5mm, surface mount Momentary Reset Switch SMD <https://www.sparkfun.com/products/8229> (COM-08229) SMD-6.2MM-TALL - 6.2mm square, surface mount Tactile Button - SMD (6mm) <https://www.sparkfun.com/products/12992> Used on SparkFun Digital Sandbox <https://www.sparkfun.com/products/12651> SMD-RIGHT-ANGLE - Right-angle, surface mount Used on SparkFun Block for Intel® Edison - Arduino <https://www.sparkfun.com/products/13036>; PROD_ID: SWCH-14278; SF_SKU: COM-08229
U1 = U-OSD3358-512M-BSM:OSD3358-512M-BSM: Octavo Systems LLC OSD335x Family SiP: 21mm x 21mm, 1.27mm pitch 256 pin BGA contains AM3358, 512MB DDR3, TPS65217, TL5209, 4KB EEPROM and passives. Commerical Temperature (case): 0C to 85C.; DPN: 1676-1002-ND; MFR: Octavo Systems; MPN: OSD3358-512M-BSM; PACKAGE: BGA-400 Octavo Systems
U2 = Ava:RASPBERRY-PI+: Samtec SSW-120-01-T-D
U4 = GHI-IC:SN74LVC1G07DCK
USB1 USB2 = con-molex:53?-05: CONNECTOR wire to board 1.25 mm (.049 inch) pitch header; MF: MOLEX; OC_FARNELL: 1433644; OC_NEWARK: unknown
Y1 = SamacSys_Parts:TSX-3225_24.0000MF15V-C0: Crystals XTAL +/-10PPM +/-15PPM -20~70C 18PF 1K TR Source: Datasheet <https://support.epson.biz/td/api/doc_check.php?dl=brief_TSX-3225&lang=en>; DESCRIPTION: Crystals XTAL +/-10PPM +/-15PPM -20~70C 18PF 1K TR; HEIGHT: 0.6mm; MANUFACTURER_NAME: Epson Timing; MANUFACTURER_PART_NUMBER: TSX-3225 24.0000MF15V-C0; MOUSER_PART_NUMBER: 732-22524MF15V-C; MOUSER_PRICE-STOCK: https://www.mouser.co.uk/ProductDetail/Epson-Timing/TSX-3225-240000MF15V-C0?qs=f9yNj16SXrL4CUAIw3qeqg%3D%3D
Y2 = microbuilder:CRYSTAL: Crystals HC49UP - Surface Mount Crystal 4.0MHz 18pF +/-30ppm Surface Mount Crystal [Digikey: 535-9857-1-ND] 12.0 MHz Surface Mount Crystal [Digikey: 535-9869-6-ND] 25.0 MHz Surface Mount Crystal [Digikey: 535-9078-1-ND] 2.5 x 2.0mm - MEMs SMT Crystal 16.0 MHz 10pF 20ppm 2.5 x 2.0mm Crystal [Digikey -40-85°C: 535-10923-1-ND] 3.2 x 2.5mm - MEMs SMT Crystal 12.0 MHz 8pF 15ppm 3.2 x 2.5mm Crystal [Digikey: -10-70°C: 644-1047-1-ND -40-125°C: 644-1128-1-ND] 16.0 MHz 8pF 15ppm 3.2 x 2.5mm Crystal [Digikey: -10-70°C: 644-1049-1-ND -40-125°C: 644-1129-2-ND] 16.0 MHz 10pF 10ppm 3.2 x 2.5mm Crystal [Digikey: 644-1100-1-ND] 27.12 MHz 18pF 30ppm 3.2 x 2.5mm Crystal [Digikey: 887-1424-1-ND] 27.12MHz 10pF 10ppm 3.2 x 2.5mm Crystal [Digikey: 887-1329-1-ND] 4.9 x 1.8mm - MEMs SMT Crystal 32.768 KHz 12.5pF 20ppm 4.9 x 1.8mm Crystal [Digikey: SE2415CT-ND] 8.0 x 3.8mm - Surface Mount Crystal 32.768kHz 12.5pF 20ppm -40°C-85°C [Digikey: 535-9166-2-ND] Cylinder 32.768KHz Cylinder Crystal (2x6mm body) [Ex. Digikey: 300-8341-2-ND]
Y3 = SamacSys_Parts:FA-20H_16.0000MF10Z-AJ0: Source: Datasheet <https://support.epson.biz/td/api/doc_check.php?dl=brief_FA-20H&lang=en>; HEIGHT: 0.55mm; MANUFACTURER_NAME: Epson Timing; MANUFACTURER_PART_NUMBER: FA-20H 16.0000MF10Z-AJ0; MOUSER_PART_NUMBER: 732-FA-20H16MF10ZAJ0; MOUSER_PRICE-STOCK: https://www.mouser.co.uk/ProductDetail/Epson-Timing/FA-20H-160000MF10Z-AJ0?qs=f9yNj16SXrIaU%252BY5GFRuIg%3D%3D